# Altium project MiniESC_Project.PrjPcb (part 1 of 3)
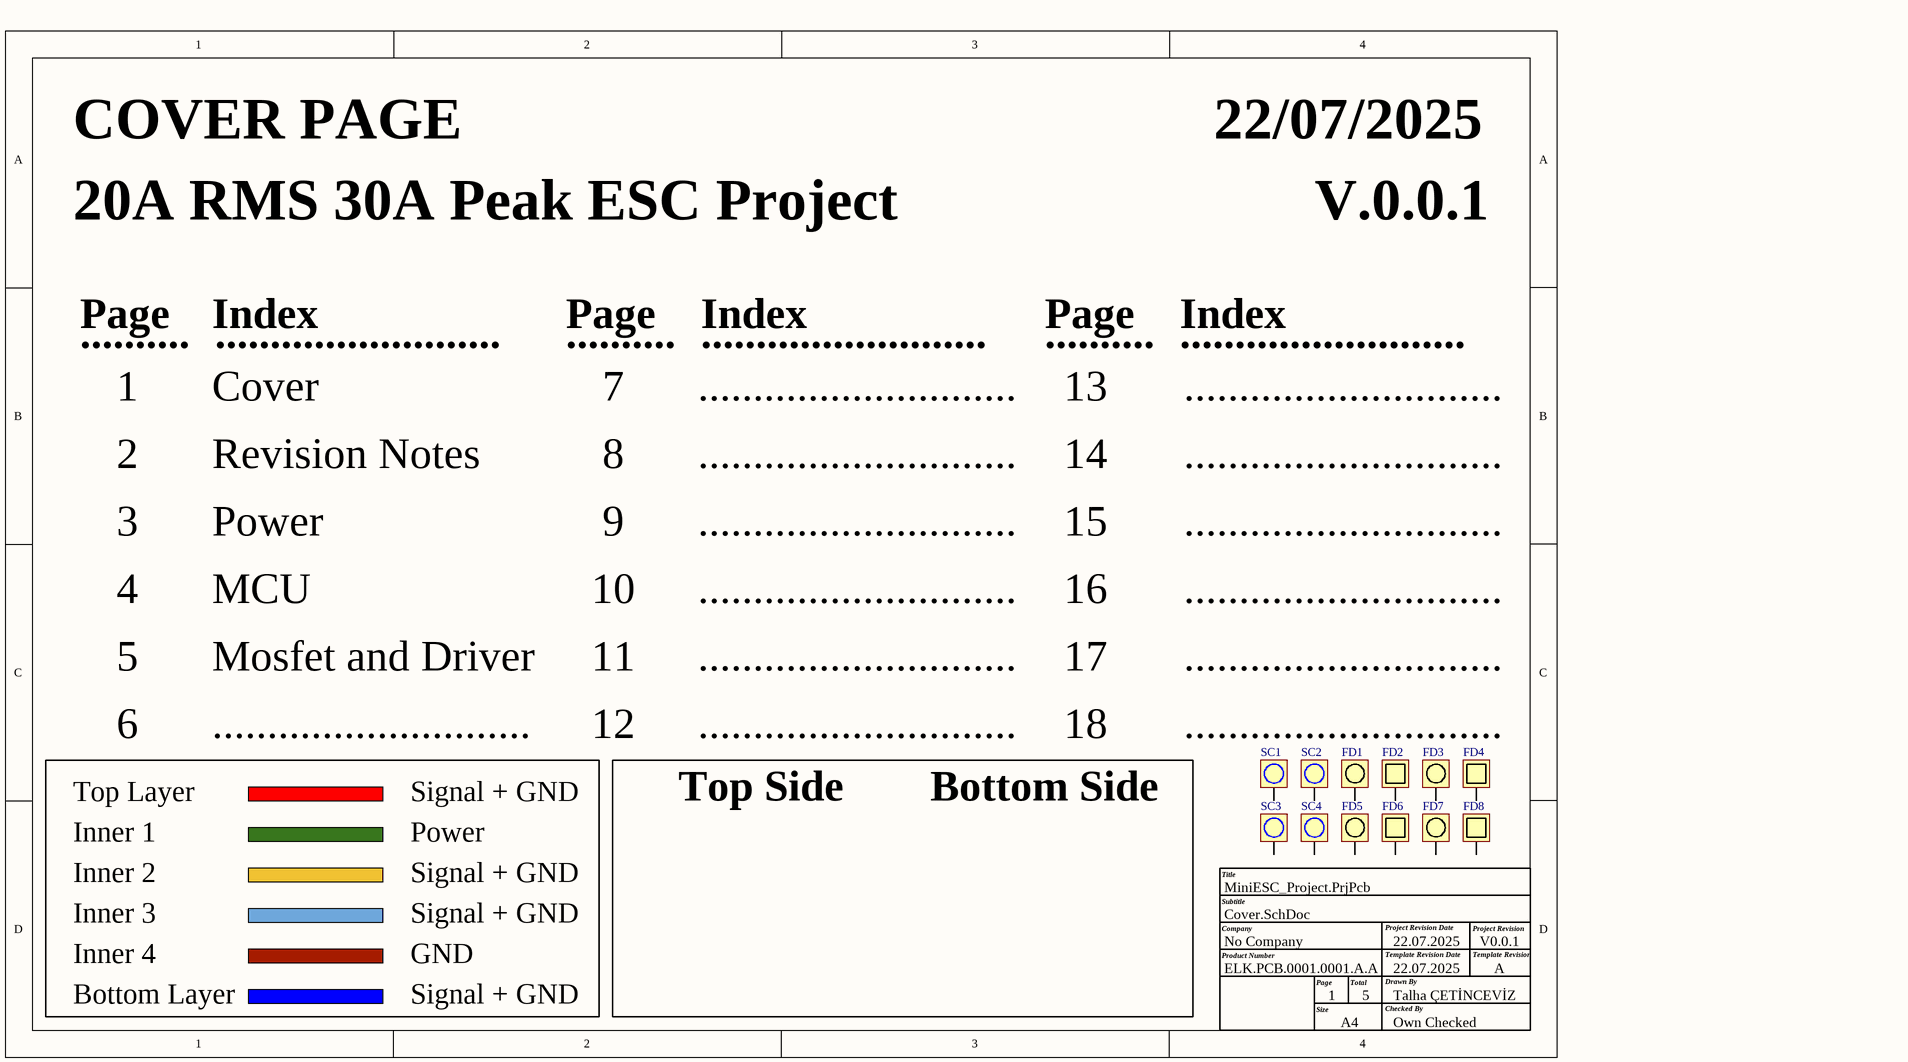
[diagram p0: Cover.SchDoc]
5 sheets, 165 parts. Net scope: flat (ports and power ports of the same name join across sheets).
Board files: MiniESC.PcbDoc, PCB_Panel.PcbDoc
Sheets:
  Cover.SchDoc
  Revision_Note.SchDoc
  Power.SchDoc
  MCU.SchDoc
  Mosfet_and_Driver.SchDoc

## Sheet Cover.SchDoc
size A4; Date: 22.07.2025; CheckedBy: Own Checked; Author: A4; CompanyName: No Company; DocumentNumber: ELK.PCB.0001.0001.A.A; Revision: V0.0.1; SheetNumber: 1; SheetTotal: 5

### Parts
FD1  Fidicual_Rounded  [FD Rounded]  (value not drawn)  (no BOM)
FD2  Fidicual_Square  [FD Square]  (value not drawn)  (no BOM)
FD3  Fidicual_Rounded  [FD Rounded]  (value not drawn)  (no BOM)
FD4  Fidicual_Square  [FD Square]  (value not drawn)  (no BOM)
FD5  Fidicual_Rounded  [FD Rounded]  (value not drawn)  (no BOM)
FD6  Fidicual_Square  [FD Square]  (value not drawn)  (no BOM)
FD7  Fidicual_Rounded  [FD Rounded]  (value not drawn)  (no BOM)
FD8  Fidicual_Square  [FD Square]  (value not drawn)  (no BOM)
SC1  Screw_M3  [SCREW M3]  (value not drawn)  (no BOM)
SC2  Screw_M3  [SCREW M3]  (value not drawn)  (no BOM)
SC3  Screw_M3  [SCREW M3]  (value not drawn)  (no BOM)
SC4  Screw_M3  [SCREW M3]  (value not drawn)  (no BOM)

### Nets

Not connected (* = marked no-connect by the designer): FD1 1; FD2 1; FD3 1; FD4 1; FD5 1; FD6 1; FD7 1; FD8 1; SC1 1; SC2 1; SC3 1; SC4 1

### Notes on the sheet
- COVER PAGE
- 22/07/2025
- 20A RMS 30A Peak ESC Project
- V.0.0.1
- Page
- ..........
- Index
- ..........................
- 1
- Cover
- 7
- .............................
- 13
- 2
- Revision Notes
- 8
- 14
- 3
- Power
- 9
- 15
- 4
- MCU
- 10
- 16
- 5
- Mosfet and Driver
- 11
- 17
- 6
- 12
- 18
- Top Layer
- Inner 1
- Signal + GND
- Top Side
- Bottom Side
- Inner 2
- Inner 3
- Inner 4
- GND
- Bottom Layer
- Title
- Company
- Product Number
- Subtitle
- Project Revision Date
- Template Revision Date
- Project Revision
- Template Revision
- Size
- A4
- Total
- Checked By
- Drawn By
- 22.07.2025
- Talha ÇETİNCEVİZ
- A

### Library data of the parts
SC1-SC4 = Screw_M3: Screw hole Metric 3

## Sheet Revision_Note.SchDoc
size A4; Date: 22.07.2025; CheckedBy: Own Checked; Author: A4; CompanyName: No Company; DocumentNumber: ELK.PCB.0001.0001.A.A; Revision: V0.0.1; SheetNumber: 2; SheetTotal: 5
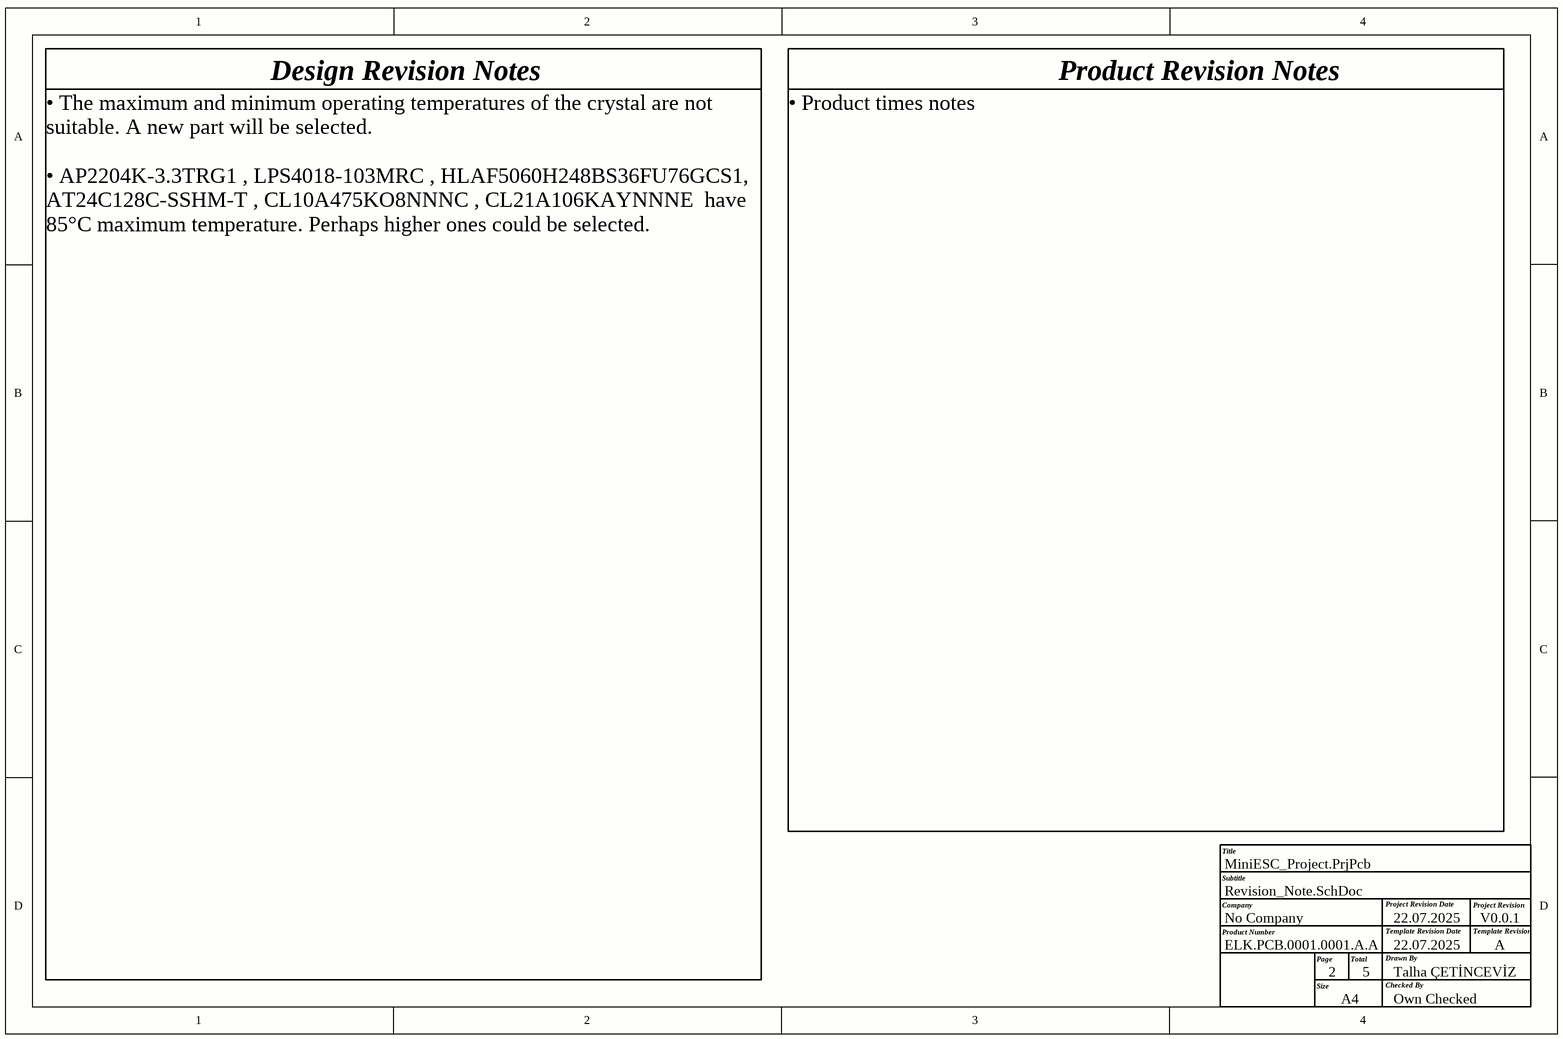
[diagram p1: Revision_Note.SchDoc]

### Notes on the sheet
- Design Revision Notes
- Product Revision Notes
- • Product times notes
- • The maximum and minimum operating temperatures of the crystal are not suitable. A new part will be selected.
  • AP2204K-3.3TRG1 , LPS4018-103MRC , HLAF5060H248BS36FU76GCS1, AT24C128C-SSHM-T , CL10A475KO8NNNC , CL21A106KAYNNNE  have 85°C maximum temperature. Perhaps higher ones could be selected.
- Title
- Company
- Product Number
- Subtitle
- Project Revision Date
- Template Revision Date
- Project Revision
- Template Revision
- Size
- Page
- A4
- Total
- Checked By
- Drawn By
- 22.07.2025
- Talha ÇETİNCEVİZ
- A

## Sheet Power.SchDoc
size A4; Date: 22.07.2025; CheckedBy: Own Checked; CompanyName: No Company; DocumentNumber: ELK.PCB.0001.0001.A.A; Revision: V0.0.1; SheetNumber: 3; SheetTotal: 5
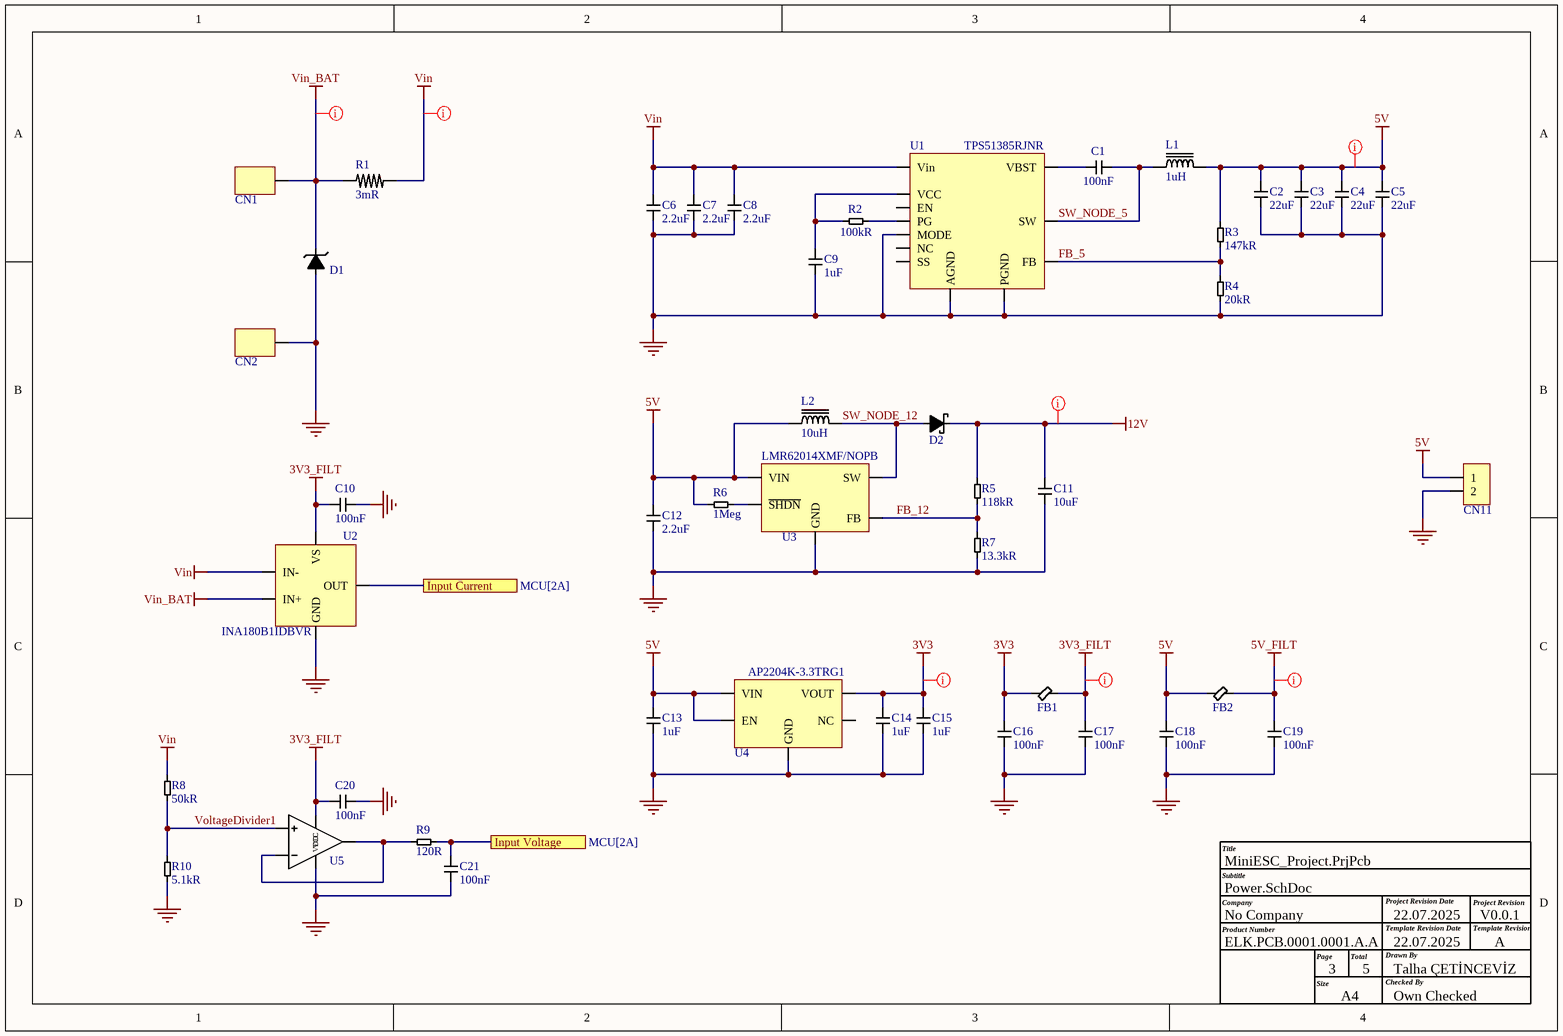
[diagram p2: Power.SchDoc]

### Parts
C1  value 100nF  [CAP 0805]  (hidden comment: CL21B104KBCNNNC)
C2  value 22uF  [CAP 1206]  (hidden comment: CL31B226KPHNNNE)
C3  value 22uF  [CAP 1206]  (hidden comment: CL31B226KPHNNNE)
C4  value 22uF  [CAP 1206]  (hidden comment: CL31B226KPHNNNE)
C5  value 22uF  [CAP 1206]  (hidden comment: CL31B226KPHNNNE)
C6  value 2.2uF  [CAP 1206]  (hidden comment: CL31B225KBHNNNE)
C7  value 2.2uF  [CAP 1206]  (hidden comment: CL31B225KBHNNNE)
C8  value 2.2uF  [CAP 1206]  (hidden comment: CL31B225KBHNNNE)
C9  value 1uF  [CAP 0805]  (hidden comment: CC0805KKX7R9BB105)
C10  value 100nF  [CAP 0603]  (hidden comment: CC0603KRX7R9BB104)
C11  value 10uF  [CAP 0805]  (hidden comment: CL21A106KAYNNNE)
C12  value 2.2uF  [CAP 1206]  (hidden comment: CL31B225KBHNNNE)
C13  value 1uF  [CAP 1206]  (hidden comment: CL31B105KOFNNNE)
C14  value 1uF  [CAP 1206]  (hidden comment: CL31B105KOFNNNE)
C15  value 1uF  [CAP 1206]  (hidden comment: CL31B105KOFNNNE)
C16  value 100nF  [CAP 0603]  (hidden comment: CC0603KRX7R9BB104)
C17  value 100nF  [CAP 0603]  (hidden comment: CC0603KRX7R9BB104)
C18  value 100nF  [CAP 0603]  (hidden comment: CC0603KRX7R9BB104)
C19  value 100nF  [CAP 0603]  (hidden comment: CC0603KRX7R9BB104)
C20  value 100nF  [CAP 0603]  (hidden comment: CC0603KRX7R9BB104)
C21  value 100nF  [CAP 0603]  (hidden comment: CC0603KRX7R9BB104)
CN1  SMD PAD 1  [SMD PAD 1]  (value not drawn)  (no BOM)
CN2  SMD PAD 1  [SMD PAD 1]  (value not drawn)  (no BOM)
CN11  2 Pin SMD  [2 Pin SMD]  (value not drawn)  (no BOM)
D1  SMAJ33CA-HT  [SMA]  (value not drawn)
D2  SL02-GS08  [DO-219AB]  (value not drawn)
FB1  BLM18EG601SN1D  [FB 0603]  (value not drawn)
FB2  BLM18EG601SN1D  [FB 0603]  (value not drawn)
L1  value 1uH  [11x10]  (hidden comment: MGAH10041R0M-10)
L2  value 10uH  [3.9x3.9]  (hidden comment: LPS4018-103MRC)
R1  value 3mR  [3920]  (hidden comment: BVS-A-R003-1.0)
R2  value 100kR  [RES 0603]  (hidden comment: RC0603FR-07100KL)
R3  value 147kR  [RES 0603]  (hidden comment: 0603SAF1473T5E)
R4  value 20kR  [RES 0603]  (hidden comment: 0603SAF2002T5E)
R5  value 118kR  [RES 0603]  (hidden comment: 0603SAF1183T5E)
R6  value 1Meg  [RES 0603]  (hidden comment: 0603SAJ0105T5E)
R7  value 13.3kR  [RES 0603]  (hidden comment: RC0603FR-0713K3L)
R8  value 50kR  [RES 0805]  (hidden comment: 0805S8F5002T5E)
R9  value 120R  [RES 0603]  (hidden comment: 0603SAF1200T5E)
R10  value 5.1kR  [RES 0603]  (hidden comment: 0603SAF5101T5E)
U1  TPS51385RJNR  [PWQFN-12]
U2  INA180B1IDBVR  [SOT23-5]
U3  LMR62014XMF/NOPB  [SOT23-5]
U4  AP2204K-3.3TRG1  [SOT23-5]
U5  LMV321ILT  [SOT23-5]  (value not drawn)

### Ports
Input Current (see MCU[2A]), Input Voltage (see MCU[2A])

### Nets
3V3: C14.2 C15.2 C16.2 FB1.1 U4.5(VOUT)
3V3_FILT: C10.1 C17.2 C20.1 FB1.2 U2.5(VS) U5.5(VCC)
5V: C2.2 C3.2 C4.2 C5.2 C12.2 C13.2 C18.2 CN11.1 FB2.1 L1.2 L2.1 R3.2 R6.1 U3.5(VIN) U4.1(VIN) U4.3(EN)
5V_FILT: C19.2 FB2.2
12V: C11.2 D2.C R5.2
GND: C2.1 C3.1 C4.1 C5.1 C6.1 C7.1 C8.1 C9.1 C10.2 C11.1 C12.1 C13.1 C14.1 C15.1 C16.1 C17.1 C18.1 C19.1 C20.2 C21.1 CN2.1 CN11.2 D1.A R4.1 R7.1 R10.1 U1.2(PGND) U1.10(AGND) U1.12(MODE) U2.2(GND) U3.2(GND) U4.2(GND) U5.2(VDD)
Vin: C6.2 C7.2 C8.2 R1.2 R8.2 U1.1(Vin) U2.4(IN-)
Vin_BAT: CN1.1 D1.C R1.1 U2.3(IN+)
ADC1: U2.1(OUT) ; port Input Current
ADC2: C21.2 R9.2 ; port Input Voltage
FB_5: R3.1 R4.2 U1.4(FB)
FB_12: R5.1 R7.2 U3.3(FB)
SW_NODE_5: C1.2 L1.1 U1.7(SW)
SW_NODE_12: D2.A L2.2 U3.1(SW)
VoltageDivider1: R8.1 R10.2 U5.1(NON_Inverting_input)
NetC1_1: C1.1 U1.8(VBST)
NetC9_2: C9.2 R2.1 U1.9(VCC)
NetR2_2: R2.2 U1.3(PG)
NetR6_2: R6.2 U3.4(~{SHDN})
NetR9_1: R9.1 U5.3(Inverting_Input) U5.4(Output)

Not connected (* = marked no-connect by the designer): U1 5(SS) 6(NC) 11(EN); U4 4(NC)

### Layout directives
net class Vin: Vin, Vin_BAT
net class 12V: 12V
net class 5V: 5V, 5V_FILT
net class 3V3: 3V3, 3V3_FILT

### Notes on the sheet
- Title
- Company
- Product Number
- Subtitle
- Project Revision Date
- Template Revision Date
- Project Revision
- Template Revision
- Size
- Page
- A4
- Total
- Checked By
- Drawn By
- 22.07.2025
- Talha ÇETİNCEVİZ
- A

### Library data of the parts
C1 = CL21B104KBCNNNC: 50V 100nF X7R ±10% 0805 Multilayer Ceramic Capacitors MLCC - SMD/SMT ROHS; Manufacturer: Samsung; Supplier: Ozdisan; Supplier Part Number: CL21B104KBCNNNC; Manufacturer Part Number: CL21B104KBCNNNC; RoHS: Yes; Category: Ceramic Capacitors; Stock: 648000; Pricing: 4000=0,00539, 8000=0,00525, 16000=0,00508, 24000=0,0049, 32000=0,00473 (USD); Mounting Technology: Surface Mount; Case/Package: 0805; Case Code (Metric): 2012; Case Code (Imperial): 0805; Material: Ceramic; Min Operating Temperature: -55°C; Max Operating Temperature: 125°C; Tolerance: 10%; Dielectric: X7R; Packaging: Tape and Reel; Voltage Rating: 50V; Voltage: 50V; Series: CL; Construction: Flat; Voltage Rating (DC): 50V; Length: 2mm; Width: 0.049inch; Height: 0.85mm; Depth: 1.25mm; Thickness: 0.037inch; Radiation Hardening: No; RoHS Compliant: Yes; Lead Free: 5697LeadFree; ComponentLink1URL: https://datasheet.ciiva.com/25710/cl21b104kbcnnnc-25710182.pdf?src-supplier=Digikey; ComponentLink1Description: https://datasheet.ciiva.com/25710/cl21b104kbcnnnc-25710182.pdf?src-supplier=Digikey; ComponentLink2URL: https://datasheet.ciiva.com/29199/454152-da-01-en-vs-kondensator-0805-29199814.pdf?src-supplier=Conrad; ComponentLink2Description: https://datasheet.ciiva.com/29199/454152-da-01-en-vs-kondensator-0805-29199814.pdf?src-supplier=Conrad
C2-C5 = CL31B226KPHNNNE: Multilayer Ceramic Capacitor, 22 uF, 10 V, ± 10%, X7R, 1206 [3216 Metric]; Manufacturer: Samsung; Material: 4241ConductorMaterial; Voltage Rating: 10V; Supplier: Ozdisan; Supplier Part Number: CL31B226KPHNNNE; Manufacturer Part Number: CL31B226KPHNNNE; RoHS: Yes; Category: Ceramic Capacitors; Stock: 10000; Pricing: 2000=0,105, 4000=0,102, 8000=0,099, 12000=0,096, 20000=0,093 (USD); Mounting Technology: Surface Mount; Case/Package: 1206; Case Code (Metric): 3216; Case Code (Imperial): 1206; Min Operating Temperature: -55°C; Max Operating Temperature: 125°C; Package Quantity: 1; Packaging: Tape and Reel; Series: CL; Tolerance: 10%; Dielectric: X7R; Voltage Rating (DC): 10V; Length: 0.126inch; Width: 0.063inch; Thickness: 0.071inch; Depth: 1.6mm; Radiation Hardening: No; RoHS Compliant: Yes; Lead Free: 5697LeadFree; ComponentLink1URL: https://datasheet.ciiva.com/25724/cl31b226kphnnne-25724443.pdf?src-supplier=Digikey; ComponentLink1Description: https://datasheet.ciiva.com/25724/cl31b226kphnnne-25724443.pdf?src-supplier=Digikey; ComponentLink2URL: https://datasheet.ciiva.com/16384/cl31b226kphnnne-16384588.pdf?src-supplier=Future+Electronics; ComponentLink2Description: https://datasheet.ciiva.com/16384/cl31b226kphnnne-16384588.pdf?src-supplier=Future+Electronics; ComponentLink3URL: https://datasheet.ciiva.com/26838/getdatasheetpartid-710483-26838941.pdf?src-supplier=Verical; ComponentLink3Description: https://datasheet.ciiva.com/26838/getdatasheetpartid-710483-26838941.pdf?src-supplier=Verical
C6-C8 C12 = CL31B225KBHNNNE: 50V 2.2uF X7R ±10% 1206 Multilayer Ceramic Capacitors MLCC - SMD/SMT ROHS; Manufacturer: Samsung; Supplier: Ozdisan; Supplier Part Number: CL31B225KBHNNNE; Manufacturer Part Number: CL31B225KBHNNNE; RoHS: Yes; Category: Ceramic Capacitors; Stock: 1046000; Pricing: 2000=0,0366, 4000=0,0357, 6000=0,0352, 10000=0,0324, 14000=0,0321, 20000=0,0309, 50000=0,0284, 100000=0,0278, 200000=0,0265 (USD); Mounting Technology: Surface Mount; Case/Package: 1206; Case Code (Metric): 3216; Case Code (Imperial): 1206; Material: Ceramic; Min Operating Temperature: -55°C; Max Operating Temperature: 125°C; Tolerance: 10%; Dielectric: X7R; Packaging: Tape and Reel; Voltage Rating: 50V; Voltage Rating (DC): 50V; Voltage: 50V; Series: CL; Construction: Flat; Length: 3.2mm; Height: 1.6mm; Depth: 1.6mm; Radiation Hardening: No; Lead Free: Lead Free; RoHS Compliant: Yes; ComponentLink1URL: https://datasheet.ciiva.com/25710/cl31b225kbhnnne-25710916.pdf?src-supplier=Digikey; ComponentLink1Description: https://datasheet.ciiva.com/25710/cl31b225kbhnnne-25710916.pdf?src-supplier=Digikey; ComponentLink2URL: https://datasheet.ciiva.com/26838/getdatasheetpartid-354100-26838937.pdf?src-supplier=Verical; ComponentLink2Description: https://datasheet.ciiva.com/26838/getdatasheetpartid-354100-26838937.pdf?src-supplier=Verical; ComponentLink3URL: https://datasheet.ciiva.com/26310/mlcc-catalogdownload2013-eng-26310094.pdf?src-supplier=Distrelec; ComponentLink3Description: https://datasheet.ciiva.com/26310/mlcc-catalogdownload2013-eng-26310094.pdf?src-supplier=Distrelec
C9 = CC0805KKX7R9BB105: Ceramic Capacitor, Ceramic, 50V, 10% +Tol, 10% -Tol, X7R, 15% TC, 1uF, Surface Mount, 0805; Manufacturer: Yageo; Material: 4241ConductorMaterial; Supplier: Ozdisan; Supplier Part Number: CC0805KKX7R9BB105; Manufacturer Part Number: CC0805KKX7R9BB105; RoHS: Yes; Category: Ceramic Capacitors; Stock: 369000; Pricing: 3000=0,009, 12000=0,0087, 30000=0,0085, 75000=0,0083, 120000=0,008 (USD); Mounting Technology: Surface Mount; Case/Package: 0805; Case Code (Imperial): 0805; Case Code (Metric): 2012; Weight: 0.000194oz; Min Operating Temperature: -55°C; Max Operating Temperature: 125°C; Tolerance: 10%; Packaging: Tape and Reel; Voltage Rating: 50V; Voltage Rating (DC): 50V; Dielectric: X7R; Termination: SMD/SMT; Series: CC; Lead Free: 5697LeadFree; Halogen Free: 5694HalogenFree; RoHS Compliant: Yes; ComponentLink1URL: https://datasheet.ciiva.com/13209/upy-gphc-x7r-6-3v-to-50v-8-12304-13209375.pdf?src-supplier=Mouser; ComponentLink1Description: https://datasheet.ciiva.com/13209/upy-gphc-x7r-6-3v-to-50v-8-12304-13209375.pdf?src-supplier=Mouser
C10 C16-C21 = CC0603KRX7R9BB104: Multilayer Ceramic Capacitor, CC Series, 0.1 - F, - 10%, X7R, 50 V, 0603 [1608 Metric]; Manufacturer: Yageo; Dielectric Material: 4241ConductorMaterial; Voltage Rating: 50V; Supplier: Ozdisan; Supplier Part Number: CC0603KRX7R9BB104; Manufacturer Part Number: CC0603KRX7R9BB104; RoHS: Yes; Category: Ceramic Capacitors; Stock: 5600000; Pricing: 4000=0,0018, 20000=0,0017, 80000=0,0017, 200000=0,0016, 500000=0,0015 (USD); Mounting Technology: Surface Mount; Case/Package: 0603; Pins: 2; Case Code (Metric): 1608; Case Code (Imperial): 0603; Material: 4241ConductorMaterial; Min Operating Temperature: -55°C; Max Operating Temperature: 125°C; Tolerance: 10%; Dielectric: X7R; Termination: SMD/SMT; Voltage: 50V; Package Quantity: 1; Packaging: Tape and Reel; Series: CC; Length: 0.063inch; Width: 0.031inch; Height: 0.8mm; Thickness: 0.035inch; Depth: 0.8mm; Radiation Hardening: No; Reach SVHC Compliant: No; Lead Free: 5697LeadFree; Halogen Free: 5694HalogenFree; RoHS Compliant: Yes; ComponentLink1URL: https://datasheet.ciiva.com/11786/0900766b80d84f1d-11786061.pdf?src-supplier=Rs; ComponentLink1Description: https://datasheet.ciiva.com/11786/0900766b80d84f1d-11786061.pdf?src-supplier=Rs; ComponentLink2URL: https://datasheet.ciiva.com/8033/70765-8033821.pdf?src-supplier=Element14; ComponentLink2Description: https://datasheet.ciiva.com/8033/70765-8033821.pdf?src-supplier=Element14; ComponentLink3URL: https://datasheet.ciiva.com/7978/1489800-7978166.pdf?src-supplier=Element14; ComponentLink3Description: https://datasheet.ciiva.com/7978/1489800-7978166.pdf?src-supplier=Element14; ComponentLink4URL: https://datasheet.ciiva.com/144/mlccorderingcode-144177.pdf?src-supplier=Digikey; ComponentLink4Description: https://datasheet.ciiva.com/144/mlccorderingcode-144177.pdf?src-supplier=Digikey; ComponentLink5URL: https://datasheet.ciiva.com/144/mlccorderingcode-144176.pdf?src-supplier=Digikey; ComponentLink5Description: https://datasheet.ciiva.com/144/mlccorderingcode-144176.pdf?src-supplier=Digikey; ComponentLink6URL: https://datasheet.ciiva.com/144/mlccorderingcode-144178.pdf?src-supplier=Digikey; ComponentLink6Description: https://datasheet.ciiva.com/144/mlccorderingcode-144178.pdf?src-supplier=Digikey; ComponentLink7URL: https://datasheet.ciiva.com/8033/70765-8033819.pdf?src-supplier=Element14; ComponentLink7Description: https://datasheet.ciiva.com/8033/70765-8033819.pdf?src-supplier=Element14; ComponentLink8URL: https://datasheet.ciiva.com/31394/1489800-31394927.pdf?src-supplier=Farnell; ComponentLink8Description: https://datasheet.ciiva.com/31394/1489800-31394927.pdf?src-supplier=Farnell; ComponentLink9URL: https://datasheet.ciiva.com/22749/1489800-22749214.pdf?src-supplier=Element14; ComponentLink9Description: https://datasheet.ciiva.com/22749/1489800-22749214.pdf?src-supplier=Element14
C11 = CL21A106KAYNNNE: 25V 10uF X5R ±10% 0805 Multilayer Ceramic Capacitors MLCC - SMD/SMT ROHS; Manufacturer: Samsung; Supplier: Ozdisan; Supplier Part Number: CL21A106KAYNNNE; Manufacturer Part Number: CL21A106KAYNNNE; RoHS: Yes; Category: Ceramic Capacitors; Stock: 3442000; Pricing: 2000=0,00823 (USD); Mounting Technology: Surface Mount; Case/Package: 0805; Case Code (Metric): 2012; Case Code (Imperial): 0805; Material: Ceramic; Min Operating Temperature: -55°C; Max Operating Temperature: 85°C; Package Quantity: 1; Packaging: Tape and Reel; Tolerance: 10%; Voltage Rating: 25V; Dielectric: X5R; Series: CL; Construction: Flat; Voltage Rating (DC): 25V; Length: 2mm; Width: 0.049inch; Height: 1.25mm; Thickness: 0.057inch; Depth: 1.25mm; Radiation Hardening: No; RoHS Compliant: Yes; ComponentLink1URL: https://datasheet.ciiva.com/25796/cl21a106kaynnne-25796720.pdf?src-supplier=Digikey; ComponentLink1Description: https://datasheet.ciiva.com/25796/cl21a106kaynnne-25796720.pdf?src-supplier=Digikey; ComponentLink2URL: https://datasheet.ciiva.com/26838/getdatasheetpartid-357558-26838583.pdf?src-supplier=Verical; ComponentLink2Description: https://datasheet.ciiva.com/26838/getdatasheetpartid-357558-26838583.pdf?src-supplier=Verical
C13-C15 = CL31B105KOFNNNE: Cap Ceramic 1uF 16V X7R 10% SMD 1206 125°C Embossed T/R; Manufacturer: Samsung; Tolerance: %10; Supplier: Ozdisan; Supplier Part Number: CL31B105KOFNNNE; Manufacturer Part Number: CL31B105KOFNNNE; RoHS: Yes; Category: Ceramic Capacitors; Stock: 124000; Pricing: 2000=0,01378, 4000=0,01343, 8000=0,01083, 12000=0,01253, 16000=0,01208 (USD); Voltage Rating (DC): 16V; ComponentLink1URL: https://datasheet.ciiva.com/25798/cl31b105kofnnne-25798673.pdf?src-supplier=Digikey; ComponentLink1Description: https://datasheet.ciiva.com/25798/cl31b105kofnnne-25798673.pdf?src-supplier=Digikey; ComponentLink2URL: https://datasheet.ciiva.com/26838/getdatasheetpartid-358370-26838906.pdf?src-supplier=Verical; ComponentLink2Description: https://datasheet.ciiva.com/26838/getdatasheetpartid-358370-26838906.pdf?src-supplier=Verical; ComponentLink3URL: https://datasheet.ciiva.com/29200/453334-da-01-en-vs-kondensator-1206-29200316.pdf?src-supplier=Conrad; ComponentLink3Description: https://datasheet.ciiva.com/29200/453334-da-01-en-vs-kondensator-1206-29200316.pdf?src-supplier=Conrad; ComponentLink4URL: https://datasheet.ciiva.com/26310/mlcc-catalogdownload2013-eng-26310089.pdf?src-supplier=Distrelec; ComponentLink4Description: https://datasheet.ciiva.com/26310/mlcc-catalogdownload2013-eng-26310089.pdf?src-supplier=Distrelec; Dielectric: X7R; Material: Ceramic; Min Operating Temperature: -55°C; Max Operating Temperature: 125°C; Case/Package: 1206
D1 = SMAJ33CA-HT: DIODE TVS 400W 33V DO214AC SMA; Manufacturer: Taiwan Semiconductor; Manufacturer Part Number: SMAJ33CAH; Supplier: Ozdisan; Supplier Part Number: SMAJ33CA-HT; RoHS: No; Stock: 97379; Pricing: 1=0,5, 10=0,31, 50=0,31, 100=0,197, 1000=0,119, 10000=0,096 (USD); Min Operating Temperature: -55°C; Max Operating Temperature: 150°C; Case/Package: SMA; Category: TVS Diode
D2 = SL02-GS08: Rectifier Diode Schottky 20V 1.1A 10ns Automotive 2-Pin SMF T/R; Manufacturer: Vishay; Max Reverse Current: 250uA; Peak Non-Repetitive Surge Current: 40A; Supplier: Ozdisan; Supplier Part Number: SL02-GS08; Manufacturer Part Number: SL02-GS08; RoHS: Yes; Category: Rectifier Diodes; Stock: 30181; Pricing: 1=0,25, 10=0,192, 50=0,192, 100=0,184, 1000=0,121, 10000=0,095 (USD); Mounting Technology: Surface Mount; Case/Package: DO-219AB; Pins: 2; Min Operating Temperature: -55°C; Max Operating Temperature: 125°C; Forward Current: 1.1A; Packaging: Cut Tape; Package Quantity: 1; Average Rectified Current: 1.1A; Reverse Recovery Time: 10ns; Max Repetitive Reverse Voltage (Vrrm): 20V; Max Forward Surge Current (Ifsm): 40A; Max Reverse Voltage (DC): 20V; RoHS Compliant: Yes; Reach SVHC Compliant: Unknown; ComponentLink1URL: https://datasheet.ciiva.com/8290/sl02-8290576.pdf?src-supplier=Avnet; ComponentLink1Description: https://datasheet.ciiva.com/8290/sl02-8290576.pdf?src-supplier=Avnet; ComponentLink2URL: https://datasheet.ciiva.com/4714/85687-201208-4714309.pdf?src-supplier=Mouser; ComponentLink2Description: https://datasheet.ciiva.com/4714/85687-201208-4714309.pdf?src-supplier=Mouser; ComponentLink3URL: https://datasheet.ciiva.com/25932/sl02-25932747.pdf?; ComponentLink3Description: https://datasheet.ciiva.com/25932/sl02-25932747.pdf?
FB1 FB2 = BLM18EG601SN1D: Ferrite Beads Multi-Layer 600Ohm 25% 100MHz 500mA 350mOhm DCR 0603 Paper T/R; Manufacturer: Murata; Manufacturer Series: BLM18E; Material: Steel,Ferrite; Impedance: 600R; Value: 350mR; Number of Lines: 1; Shielding: 202Shielding; Supplier: Ozdisan; Supplier Part Number: BLM18EG601SN1D; Manufacturer Part Number: BLM18EG601SN1D; RoHS: Yes; Category: Ferrite Beads and Chips; Stock: 324000; Pricing: 4000=0,0204, 12000=0,0199, 20000=0,0196, 40000=0,0193, 80000=0,0189 (USD); Case/Package: 0603; Pins: 2; Core Material: Ferrite; Case Code (Metric): 1608; Case Code (Imperial): 0603; Terminal Finish: Tin; Min Operating Temperature: -55°C; Max Operating Temperature: 125°C; Tolerance: 25%; Package Quantity: 1; Packaging: Tape and Reel; Current Rating: 500mA; Max Current Rating: 500mA; DC Resistance (DCR): 350mR; Termination: SMD/SMT; Max DC Current: 500mA; Test Frequency: 100MHz; DC Current: 500mA; Frequency: 100MHz; Number of Circuits: 1; Series: BLM18E; DC Resistance-Max: 350mR; Channels: 1; RMS Current (Irms): 500mA; ESR: 350mR; Length: 1.6mm; Width: 0.8mm; Height: 0.8mm; Depth: 0.8mm; Radiation Hardening: No; Reach SVHC Compliant: No; Military Standard: Not; Lead Free: Lead Free; RoHS Compliant: Yes; ComponentLink1URL: https://datasheet.ciiva.com/3854/l0110s0101blm18e-3854062.pdf?src-supplier=Arrow+Electronics; ComponentLink1Description: https://datasheet.ciiva.com/3854/l0110s0101blm18e-3854062.pdf?src-supplier=Arrow+Electronics; ComponentLink2URL: https://datasheet.ciiva.com/18093/getdatasheetpartid-152954-18093061.pdf?src-supplier=Verical; ComponentLink2Description: https://datasheet.ciiva.com/18093/getdatasheetpartid-152954-18093061.pdf?src-supplier=Verical; ComponentLink3URL: https://datasheet.ciiva.com/36526/1844942-36526047.pdf?src-supplier=Jameco; ComponentLink3Description: https://datasheet.ciiva.com/36526/1844942-36526047.pdf?src-supplier=Jameco; ComponentLink4URL: https://datasheet.ciiva.com/11799/0900766b811b5866-11799831.pdf?src-supplier=Rs; ComponentLink4Description: https://datasheet.ciiva.com/11799/0900766b811b5866-11799831.pdf?src-supplier=Rs; ComponentLink5URL: https://datasheet.ciiva.com/41449/001172270-da-01-en-drossel-0603-600r-1-6x0-8mm-4000st-41449585.pdf?src-supplier=Conrad; ComponentLink5Description: https://datasheet.ciiva.com/41449/001172270-da-01-en-drossel-0603-600r-1-6x0-8mm-4000st-41449585.pdf?src-supplier=Conrad; ComponentLink6URL: https://datasheet.ciiva.com/1467/5169-1467238.pdf?src-supplier=Element14; ComponentLink6Description: https://datasheet.ciiva.com/1467/5169-1467238.pdf?src-supplier=Element14; ComponentLink7URL: https://datasheet.ciiva.com/1012/l0110s0101blm18e-1012876.pdf?src-supplier=Digikey; ComponentLink7Description: https://datasheet.ciiva.com/1012/l0110s0101blm18e-1012876.pdf?src-supplier=Digikey; ComponentLink8URL: https://datasheet.ciiva.com/1012/l0110s0101blm18e-1012875.pdf?src-supplier=Digikey; ComponentLink8Description: https://datasheet.ciiva.com/1012/l0110s0101blm18e-1012875.pdf?src-supplier=Digikey; ComponentLink9URL: https://datasheet.ciiva.com/1012/l0110s0101blm18e-1012877.pdf?src-supplier=Digikey; ComponentLink9Description: https://datasheet.ciiva.com/1012/l0110s0101blm18e-1012877.pdf?src-supplier=Digikey; ComponentLink10URL: https://datasheet.ciiva.com/8084/l0110s0101blm18e-8084284.pdf?src-supplier=Avnet; ComponentLink10Description: https://datasheet.ciiva.com/8084/l0110s0101blm18e-8084284.pdf?src-supplier=Avnet; ComponentLink11URL: https://datasheet.ciiva.com/16200/l0110s0101blm18e-16200310.pdf?src-supplier=Future+Electronics; ComponentLink11Description: https://datasheet.ciiva.com/16200/l0110s0101blm18e-16200310.pdf?src-supplier=Future+Electronics; ComponentLink12URL: https://datasheet.ciiva.com/3081/l0110s0101blm18e-3081626.pdf?src-supplier=Avnet; ComponentLink12Description: https://datasheet.ciiva.com/3081/l0110s0101blm18e-3081626.pdf?src-supplier=Avnet; ComponentLink13URL: https://datasheet.ciiva.com/1467/5169-1467239.pdf?src-supplier=Element14; ComponentLink13Description: https://datasheet.ciiva.com/1467/5169-1467239.pdf?src-supplier=Element14
L1 = MGAH10041R0M-10: 1 µH Shielded Molded Inductor 18 A 3.3mOhm Max Nonstandard; Manufacturer: Laird; Core Material: Metal Composite; Max DC Current: 18 A; Tolerance: 20%; DC Resistance (DCR): 3.3 m R; Current - Saturation (Isat): 28 A; Supplier: Digikey; Supplier Part Number: 240-MGAH10041R0M-10TR-ND; Manufacturer Part Number: MGAH10041R0M-10; RoHS: No; Pricing: 8000=0,52057, 16000=0,49243, 32000=0,47947, 48000=0,42987, 64000=0,41913 (USD); Category: Inductors; Case/Package: 11x10; Min Operating Temperature: -55°C; Max Operating Temperature: 155°C; Length: 11 mm; Width: 10 mm; Height: 4.1 mm; Shielding: Shielded; Self Resonant Frequency: -
L2 = LPS4018-103MRC: Power inductor, shielded, 20/30% tol, SMT, RoHS, lead-free, halogen-free; Manufacturer: Coilcraft; Core Material: Ferrite; Tolerance: 20%; Max DC Current: 1.3A; Self Resonant Frequency: 40MHz; Test Frequency: 100kHz; Supplier: Digikey; Supplier Part Number: 2457-LPS4018-103MRC-ND; Manufacturer Part Number: LPS4018-103MRC; RoHS: No; Category: Inductors; Stock: 11; Pricing: 1=1,46, 10=1,46, 50=1,46, 100=1,46, 1000=0,745, 10000=0,744 (USD); Case/Package: 3.9x3.9; Weight: 0.003527oz; Min Operating Temperature: -40°C; Max Operating Temperature: 85°C; Shielding: Shielded; Termination: SMD/SMT; Packaging: Tape and Reel; Package Quantity: 1000; Series: LPS4018; Length: 4mm; Width: 4mm; Height: 1.7mm; RoHS Compliant: No; ComponentLink1URL: http://www.mouser.com/ds/2/597/lps4018-270702.pdf?src-supplier=Mouser; ComponentLink1Description: http://www.mouser.com/ds/2/597/lps4018-270702.pdf?src-supplier=Mouser
R1 = BVS-A-R003-1.0: RES.SHUNT 3920 3m Ohms 1% 5W AUTO ALUCHROM SMT; Manufacturer: Isabellenhütte; Supplier: Ozdisan; Supplier Part Number: BVS-A-R003-1.0; Manufacturer Part Number: BVS-A-R003-1.0; RoHS: Yes; Stock: 900; Pricing: 1=2,8765, 10=1,9428, 25=1,5178, 100=1,2221, 500=1,1183, 1000=0,8522 (USD); Min Operating Temperature: -65°C; Max Operating Temperature: 170°C; Case/Package: 3920
R2 = RC0603FR-07100KL: 100Mw Thick Film Resistors 100Ppm/ 1% 100K 0603 Chip Resistor Surface Mount Rohs; Manufacturer: Yageo; Voltage Rating (DC): 50V; Temperature Coefficient: 100ppm/°C; Supplier: Ozdisan; Supplier Part Number: RC0603FR-07100KL; Manufacturer Part Number: RC0603FR-07100KL; RoHS: Yes; Category: Chip SMD Resistors; Stock: 9150000; Pricing: 5000=0,001, 25000=0,001, 150000=0,001, 500000=0,0009, 1500000=0,0009 (USD); Case/Package: 0603; Pins: 2; Case Code (Imperial): 0603; Case Code (Metric): 1608; Min Operating Temperature: -55°C; Max Operating Temperature: 155°C; Tolerance: 1%; Packaging: Tape and Reel; Power Rating: 100mW; Voltage Rating: 50V; Termination: SMD/SMT; Resistor Type: Thick Film; Number of Terminations: 2; Features: Moisture Resistant; Series: RC; Max Power Dissipation: 100mW; Resistance Tolerance: 1%; Construction: Rectangular; Technology: THICK FILM; Length: 1.6mm; Width: 0.8mm; Height: 0.45mm; Depth: 0.8mm; Reach SVHC Compliant: No; Lead Free: 5697LeadFree; Military Standard: Not; RoHS Compliant: Yes
R3 = 0603SAF1473T5E: RES.(1608) 0603 147K Ohms 1% 1/10W-S 100PPM; Manufacturer: Multicomp; Manufacturer Part Number: MC0603SAF1473T5E; Power Rating: 100mW; Temperature Coefficient: 100ppm/°C; Voltage Rating: 75V; Case Code (Imperial): 0603; Case Code (Metric): 1608; Case/Package: 0603; Category: Uncategorized; Pins: 2; Packaging: Cut Tape; Reach SVHC Compliant: Unknown; Resistance Tolerance: 1%; Resistor Type: Thick Film; RoHS Compliant: Yes; Voltage Rating (DC): 75V; Min Operating Temperature: -55°C; Max Operating Temperature: 155°C; Supplier: Ozdisan; Supplier Part Number: 0603SAF1473T5E
R4 = 0603SAF2002T5E: RES.(1608) 0603 20K Ohms 1% 1/10W-S 100PPM; Manufacturer: Royal Electronic Factory; Temperature Coefficient: ±100PPM/°C; Voltage Rating (DC): 75 V; Power Rating: 100mW; Supplier: Ozdisan; Supplier Part Number: 0603SAF2002T5E; Manufacturer Part Number: 0603SAF2002T5E; RoHS: Yes; Category: LDO; Stock: 135000; Pricing: 10000=0,001 (USD); RoHS Compliant: Yes; ComponentLink1URL: https://datasheet.octopart.com/0603SAF2002T5E-Royal-Ohm-datasheet-165785611.pdf?src-supplier=TME; ComponentLink1Description: https://datasheet.octopart.com/0603SAF2002T5E-Royal-Ohm-datasheet-165785611.pdf?src-supplier=TME; ComponentLink2URL: https://datasheet.ciiva.com/7793/ta-677-7793947.pdf?src-supplier=Element14; ComponentLink2Description: https://datasheet.ciiva.com/7793/ta-677-7793947.pdf?src-supplier=Element14; Resistance Tolerance: 1%; Min Operating Temperature: -55°C; Max Operating Temperature: 155°C
R5 = 0603SAF1183T5E: Resistor, Thick Film, 118 Kohm, 100MW, 1%; Manufacturer: Multicomp; Manufacturer Part Number: MC0603SAF1183T5E; Temperature Coefficient: 100ppm/°C; Voltage Rating: 75V; Case Code (Imperial): 0603; Case Code (Metric): 1608; Case/Package: 0603; Category: Resistors; Pins: 2; Packaging: Cut Tape; Power Rating: 100mW; Reach SVHC Compliant: Unknown; Resistance Tolerance: 1%; Resistor Type: Thick Film; RoHS Compliant: Yes; Voltage Rating (DC): 75V; Supplier: Ozdisan; Supplier Part Number: 0603SAF1183T5E; Min Operating Temperature: -55°C; Max Operating Temperature: 155°C
R6 = 0603SAJ0105T5E: Res Thick Film 0603 1M Ohm 5% 0.1W(1/10W) ±200ppm/°C Pad SMD T/R; Manufacturer: Royal Electronic Factory; Temperature Coefficient: 100 PPM; Power Rating: 100 mW; Voltage Rating (DC): 75V; Resistance Tolerance: %5; Supplier: Ozdisan; Supplier Part Number: 0603SAJ0105T5E; Manufacturer Part Number: 0603SAJ0105T5E; RoHS: Yes; Stock: 115000; Pricing: 10000=0,001 (USD); Case/Package: 0603; Category: Resistors; Min Operating Temperature: -55°C; Max Operating Temperature: 155°C
R7 = RC0603FR-0713K3L: SMD Chip Resistor, 13.3 kohm, ï¿½ 1%, 100 mW, 0603 [1608 Metric], Thick Film, General Purpose; Manufacturer: Yageo; Power Rating: 100mW; Voltage Rating: 50V; Temperature Coefficient: 100ppm/°C; Supplier: Ozdisan; Supplier Part Number: RC0603FR-0713K3L; Manufacturer Part Number: RC0603FR-0713K3L; RoHS: Yes; Category: Chip SMD Resistors; Stock: 50000; Pricing: 5000=0,0011, 25000=0,001, 150000=0,001, 500000=0,001, 1500000=0,0009 (USD); Mounting Technology: Surface Mount; Case/Package: 0603; Case Code (Metric): 1608; Case Code (Imperial): 0603; Min Operating Temperature: -55°C; Max Operating Temperature: 155°C; Tolerance: 1%; Packaging: Tape and Reel; Number of Terminations: 2; Termination: SMD/SMT; Max Power Dissipation: 100mW; Voltage Rating (DC): 50V; Features: Moisture Resistant; Series: RC; Technology: THICK FILM; Construction: Rectangular; Length: 1.6mm; Height: 0.45mm; Depth: 0.8mm; Military Standard: Not; Lead Free: Lead Free; RoHS Compliant: Yes; ComponentLink1URL: https://datasheet.ciiva.com/11819/0900766b80f96399-11819248.pdf?src-supplier=Rs; ComponentLink1Description: https://datasheet.ciiva.com/11819/0900766b80f96399-11819248.pdf?src-supplier=Rs; ComponentLink2URL: https://datasheet.ciiva.com/15189/getdatasheetpartid-323984-15189605.pdf?src-supplier=Verical; ComponentLink2Description: https://datasheet.ciiva.com/15189/getdatasheetpartid-323984-15189605.pdf?src-supplier=Verical; ComponentLink3URL: https://datasheet.ciiva.com/2454/pyu-r-int-thick-7-2454007.pdf?src-supplier=Digikey; ComponentLink3Description: https://datasheet.ciiva.com/2454/pyu-r-int-thick-7-2454007.pdf?src-supplier=Digikey; ComponentLink4URL: https://datasheet.ciiva.com/2454/pyu-r-int-thick-7-2454008.pdf?src-supplier=Digikey; ComponentLink4Description: https://datasheet.ciiva.com/2454/pyu-r-int-thick-7-2454008.pdf?src-supplier=Digikey; ComponentLink5URL: https://datasheet.ciiva.com/2454/pyu-r-int-thick-7-2454006.pdf?src-supplier=Digikey; ComponentLink5Description: https://datasheet.ciiva.com/2454/pyu-r-int-thick-7-2454006.pdf?src-supplier=Digikey
R8 = 0805S8F5002T5E: RES.(2012) 0805 50K Ohms 1% 1/8W-S 100PPM; Manufacturer: ROYALOHM; Voltage Rating (DC): 150V; Temperature Coefficient: 100ppm/°C; Power Rating: 125mW; Supplier: Ozdisan; Supplier Part Number: 0805S8F5002T5E; Manufacturer Part Number: 0805S8F5002T5E; RoHS: Yes; Category: Chip SMD Resistors; Case/Package: 0805; Pins: 2; Case Code (Imperial): 0805; Case Code (Metric): 2012; Min Operating Temperature: -55°C; Max Operating Temperature: 155°C; Packaging: Tape and Reel; Tolerance: 1%; Voltage Rating: 150V; Termination: SMD/SMT; Resistor Type: Thick Film; Features: Moisture Resistant; Series: RC; Max Power Dissipation: 125mW; Number of Terminations: 2; Resistance Tolerance: 1%; ComponentLink1URL: https://datasheet.ciiva.com/7660/38590-7660789.pdf?src-supplier=Element14; ComponentLink1Description: https://datasheet.ciiva.com/7660/38590-7660789.pdf?src-supplier=Element14; ComponentLink2URL: https://datasheet.ciiva.com/7983/443971-7983596.pdf?src-supplier=Element14; ComponentLink2Description: https://datasheet.ciiva.com/7983/443971-7983596.pdf?src-supplier=Element14; ComponentLink3URL: https://datasheet.ciiva.com/22747/443971-22747519.pdf?src-supplier=Element14; ComponentLink3Description: https://datasheet.ciiva.com/22747/443971-22747519.pdf?src-supplier=Element14; ComponentLink4URL: https://datasheet.ciiva.com/46440/1868787-46440891.pdf?src-supplier=Element14; ComponentLink4Description: https://datasheet.ciiva.com/46440/1868787-46440891.pdf?src-supplier=Element14; ComponentLink5URL: https://datasheet.ciiva.com/7746/1738695-7746239.pdf?src-supplier=Element14; ComponentLink5Description: https://datasheet.ciiva.com/7746/1738695-7746239.pdf?src-supplier=Element14; ComponentLink6URL: https://datasheet.ciiva.com/15189/getdatasheetpartid-409289-15189591.pdf?src-supplier=Verical; ComponentLink6Description: https://datasheet.ciiva.com/15189/getdatasheetpartid-409289-15189591.pdf?src-supplier=Verical
R9 = 0603SAF1200T5E: RES.(1608) 0603 120 Ohms 1% 1/10W-S 100PPM; Manufacturer: ROYALOHM; Voltage Rating (DC): 50V; Temperature Coefficient: 100ppm/°C; Voltage Rating: 75V; Power Rating: 100mW; Supplier: Ozdisan; Supplier Part Number: 0603SAF1200T5E; Manufacturer Part Number: 0603SAF1200T5E; RoHS: Yes; Category: Chip SMD Resistors; Case/Package: 0603; Pins: 2; Case Code (Imperial): 0603; Case Code (Metric): 1608; Weight: 7.1E-05oz; Min Operating Temperature: -55°C; Max Operating Temperature: 155°C; Packaging: Tape and Reel; Tolerance: 1%; Termination: SMD/SMT; Resistor Type: Thick Film; Features: Moisture Resistant; Series: RC; Max Power Dissipation: 100mW; Number of Terminations: 2; Resistance Tolerance: 1%; Construction: Rectangular; Length: 1.6mm; Width: 0.8mm; Height: 0.45mm; Depth: 0.8mm; Lead Pitch: 0.3mm
R10 = 0603SAF5101T5E: Fixed Resistor, Metal Glaze/thick Film, 0.1W, 5100ohm, 50V, 1% +/-Tol, 0603; Manufacturer: Royal Electronic Factory; Temperature Coefficient: 100ppm/°C; Voltage Rating (DC): 75V; Power Rating: 100mW; Supplier: Ozdisan; Supplier Part Number: 0603SAF5101T5E; Manufacturer Part Number: 0603SAF5101T5E; RoHS: No; Category: Resistors; Stock: 25000; Pricing: 10000=0,001 (USD); ComponentLink1URL: https://datasheet.octopart.com/0603SAF5101T5E-Royal-Ohm-datasheet-165785611.pdf?src-supplier=TME; ComponentLink1Description: https://datasheet.octopart.com/0603SAF5101T5E-Royal-Ohm-datasheet-165785611.pdf?src-supplier=TME; ComponentLink2URL: https://datasheet.ciiva.com/7942/ta-677-7942905.pdf?src-supplier=Element14; ComponentLink2Description: https://datasheet.ciiva.com/7942/ta-677-7942905.pdf?src-supplier=Element14; Max Operating Temperature: 155°C; Case/Package: 0603; Resistance Tolerance: 1%; Min Operating Temperature: -55°C
U1 = TPS51385RJNR: 4.5-V to 24-V input, 7-A synchronous step-down voltage regulator with on-time D-CAP3 control 12-VQFN-HR -40 to 125; Manufacturer: Texas Instruments; Supplier: Digikey; Supplier Part Number: 296-TPS51385RJNRTR-ND; Manufacturer Part Number: TPS51385RJNR; RoHS: No; Stock: 1650; Pricing: 1=0,95, 10=0,681, 50=0,615, 100=0,541, 1000=0,444, 10000=0,424 (USD); Pins: 12; Length: 3mm; Width: 2mm; Thickness: 900um; Case/Package: PVQFN-12; Min Operating Temperature: -40°C; Max Operating Temperature: 125°C
U2 = INA180B1IDBVR: 26V, 350kHz current sense amplifier 5-SOT-23 -40 to 125; Manufacturer: Texas Instruments; Supplier: Ozdisan; Supplier Part Number: INA180B1IDBVR; Manufacturer Part Number: INA180B1IDBVR; RoHS: Yes; Category: Amplifiers - Op Amps, Buffer, Instrumentation; Stock: 17672; Pricing: 1=0,37, 10=0,257, 50=0,229, 100=0,198, 1000=0,167, 10000=0,147 (USD); ComponentLink1URL: http://www.ti.com/general/docs/suppproductinfo.tsp?distId=10&amp;gotoUrl=http%3A%2F%2Fwww.ti.com%2Flit%2Fgpn%2Fina180&src-supplier=Digikey; ComponentLink1Description: http://www.ti.com/general/docs/suppproductinfo.tsp?distId=10&amp;gotoUrl=http%3A%2F%2Fwww.ti.com%2Flit%2Fgpn%2Fina180&src-supplier=Digikey; ComponentLink2URL: http://www.ti.com/lit/ds/symlink/ina180.pdf?src-supplier=Digikey; ComponentLink2Description: http://www.ti.com/lit/ds/symlink/ina180.pdf?src-supplier=Digikey; Case/Package: SOT23-5; Min Operating Temperature: -40°C; Max Operating Temperature: 125°C
U3 = LMR62014XMF/NOPB: SIMPLE SWITCHER® 2.7V to 14V, 1.4A Step-Up Regulator in SOT-23 Package 5-SOT-23 -40 to 125; Manufacturer: TI National Semiconductor; Quiescent Current: 2mA; Number of Channels: 1NUMBER; Supplier: Ozdisan; Supplier Part Number: LMR62014XMF/NOPB; Manufacturer Part Number: LMR62014XMF/NOPB; RoHS: Yes; Category: Voltage Regulators - Switching; Stock: 13573; Pricing: 1=2,02, 10=1,29, 50=1,16, 100=0,948, 1000=0,657, 10000=0,561 (USD); Length: 2.9mm; Width: 1.6mm; Height: 1.45mm; Thickness: 1.2mm; Lead Free: 5697LeadFree; ComponentLink1URL: https://datasheet.ciiva.com/22669/1716576-22669414.pdf?src-supplier=Element14; ComponentLink1Description: https://datasheet.ciiva.com/22669/1716576-22669414.pdf?src-supplier=Element14; ComponentLink2URL: https://datasheet.ciiva.com/23854/1777788-23854326.pdf?src-supplier=Newark; ComponentLink2Description: https://datasheet.ciiva.com/23854/1777788-23854326.pdf?src-supplier=Newark; ComponentLink3URL: https://datasheet.ciiva.com/3231/lmr62014-3231410.pdf?src-supplier=Avnet; ComponentLink3Description: https://datasheet.ciiva.com/3231/lmr62014-3231410.pdf?src-supplier=Avnet; ComponentLink4URL: https://datasheet.ciiva.com/4879/snvs735a-74121-4879731.pdf?src-supplier=Mouser; ComponentLink4Description: https://datasheet.ciiva.com/4879/snvs735a-74121-4879731.pdf?src-supplier=Mouser; ComponentLink5URL: https://datasheet.ciiva.com/6603/lmr62014-6603804.pdf?src-supplier=Digikey; ComponentLink5Description: https://datasheet.ciiva.com/6603/lmr62014-6603804.pdf?src-supplier=Digikey; ComponentLink6URL: https://datasheet.ciiva.com/6603/lmr62014-6603807.pdf?src-supplier=Digikey; ComponentLink6Description: https://datasheet.ciiva.com/6603/lmr62014-6603807.pdf?src-supplier=Digikey; Case/Package: SOT23-5; Min Operating Temperature: -40°C; Max Operating Temperature: 125°C
U4 = AP2204K-3.3TRG1: Linear Voltage Regulator IC Positive Fixed 1 Output 3.3V 150mA SOT-23-5; Manufacturer: Diodes; Number of Outputs: 1; Min Input Voltage: 2.3V; Max Supply Voltage: 24V; Max Output current: 250mA; Reference Voltage: 1.24V; Quiescent Current: 50uA; Max Supply Current: 2.5mA; Power Supply Rejection Ratio (PSRR): 60dB; Supplier: Ozdisan; Supplier Part Number: AP2204K-3.3TRG1; Manufacturer Part Number: AP2204K-3.3TRG1; RoHS: Yes; Category: Voltage Regulators - Linear; Stock: 71303; Pricing: 1=0,53, 10=0,328, 50=0,288, 100=0,233, 1000=0,159, 10000=0,115 (USD); Mounting Technology: Surface Mount; Case/Package: SOT23-5; Pins: 5; Weight: 0.001058oz; Min Operating Temperature: -40°C; Max Operating Temperature: 85°C; Package Quantity: 3000; Packaging: Tape and Reel; Output Voltage: 3.3V; Output Current: 150mA; Number of Regulators: 1; Polarity: Positive; Output Type: Fixed; Series: -; Output Configuration: Positive; Min Output Voltage: 3.3V; Length: 3.02mm; Width: 1.7mm; Height: 1.3mm; Lead Free: Lead Free; RoHS Compliant: Yes
U5 = LMV321ILT: LMV321 Series 6 V 1 MHz Low Power Rail to Rail Operational Amplifier - SOT-23-5; Manufacturer: STMicroelectronics; Supplier: Ozdisan; Supplier Part Number: LMV321ILT; Manufacturer Part Number: LMV321ILT; RoHS: Yes; Category: Amplifiers - Op Amps, Buffer, Instrumentation; Stock: 405000; Pricing: 3000=0,0711, 9000=0,0694, 15000=0,0686, 45000=0,0669, 75000=0,0654 (USD); Lead Free: 5697LeadFree; ComponentLink1URL: https://datasheet.ciiva.com/41459/001185379-da-01-en-ic-op-amp-sgl-r-r-lmv321ilt-sot-23-5-stm-41459833.pdf?src-supplier=Conrad; ComponentLink1Description: https://datasheet.ciiva.com/41459/001185379-da-01-en-ic-op-amp-sgl-r-r-lmv321ilt-sot-23-5-stm-41459833.pdf?src-supplier=Conrad; ComponentLink2URL: https://datasheet.ciiva.com/16449/cd00079372-16449002.pdf?src-supplier=Future+Electronics; ComponentLink2Description: https://datasheet.ciiva.com/16449/cd00079372-16449002.pdf?src-supplier=Future+Electronics; ComponentLink3URL: https://datasheet.ciiva.com/1795/cd00079372-1795891.pdf?src-supplier=Digikey; ComponentLink3Description: https://datasheet.ciiva.com/1795/cd00079372-1795891.pdf?src-supplier=Digikey; ComponentLink4URL: https://datasheet.ciiva.com/1795/cd00079372-1795892.pdf?src-supplier=Digikey; ComponentLink4Description: https://datasheet.ciiva.com/1795/cd00079372-1795892.pdf?src-supplier=Digikey; ComponentLink5URL: https://datasheet.ciiva.com/1795/cd00079372-1795893.pdf?src-supplier=Digikey; ComponentLink5Description: https://datasheet.ciiva.com/1795/cd00079372-1795893.pdf?src-supplier=Digikey; ComponentLink6URL: https://datasheet.ciiva.com/11710/cd00079372-11710214.pdf?src-supplier=Avnet; ComponentLink6Description: https://datasheet.ciiva.com/11710/cd00079372-11710214.pdf?src-supplier=Avnet; ComponentLink7URL: https://datasheet.ciiva.com/8008/1733540-8008505.pdf?src-supplier=Element14; ComponentLink7Description: https://datasheet.ciiva.com/8008/1733540-8008505.pdf?src-supplier=Element14; ComponentLink8URL: https://datasheet.ciiva.com/8008/1733540-8008506.pdf?src-supplier=Element14; ComponentLink8Description: https://datasheet.ciiva.com/8008/1733540-8008506.pdf?src-supplier=Element14; Case/Package: SOT23-5; Min Operating Temperature: -40°C; Max Operating Temperature: 125°C